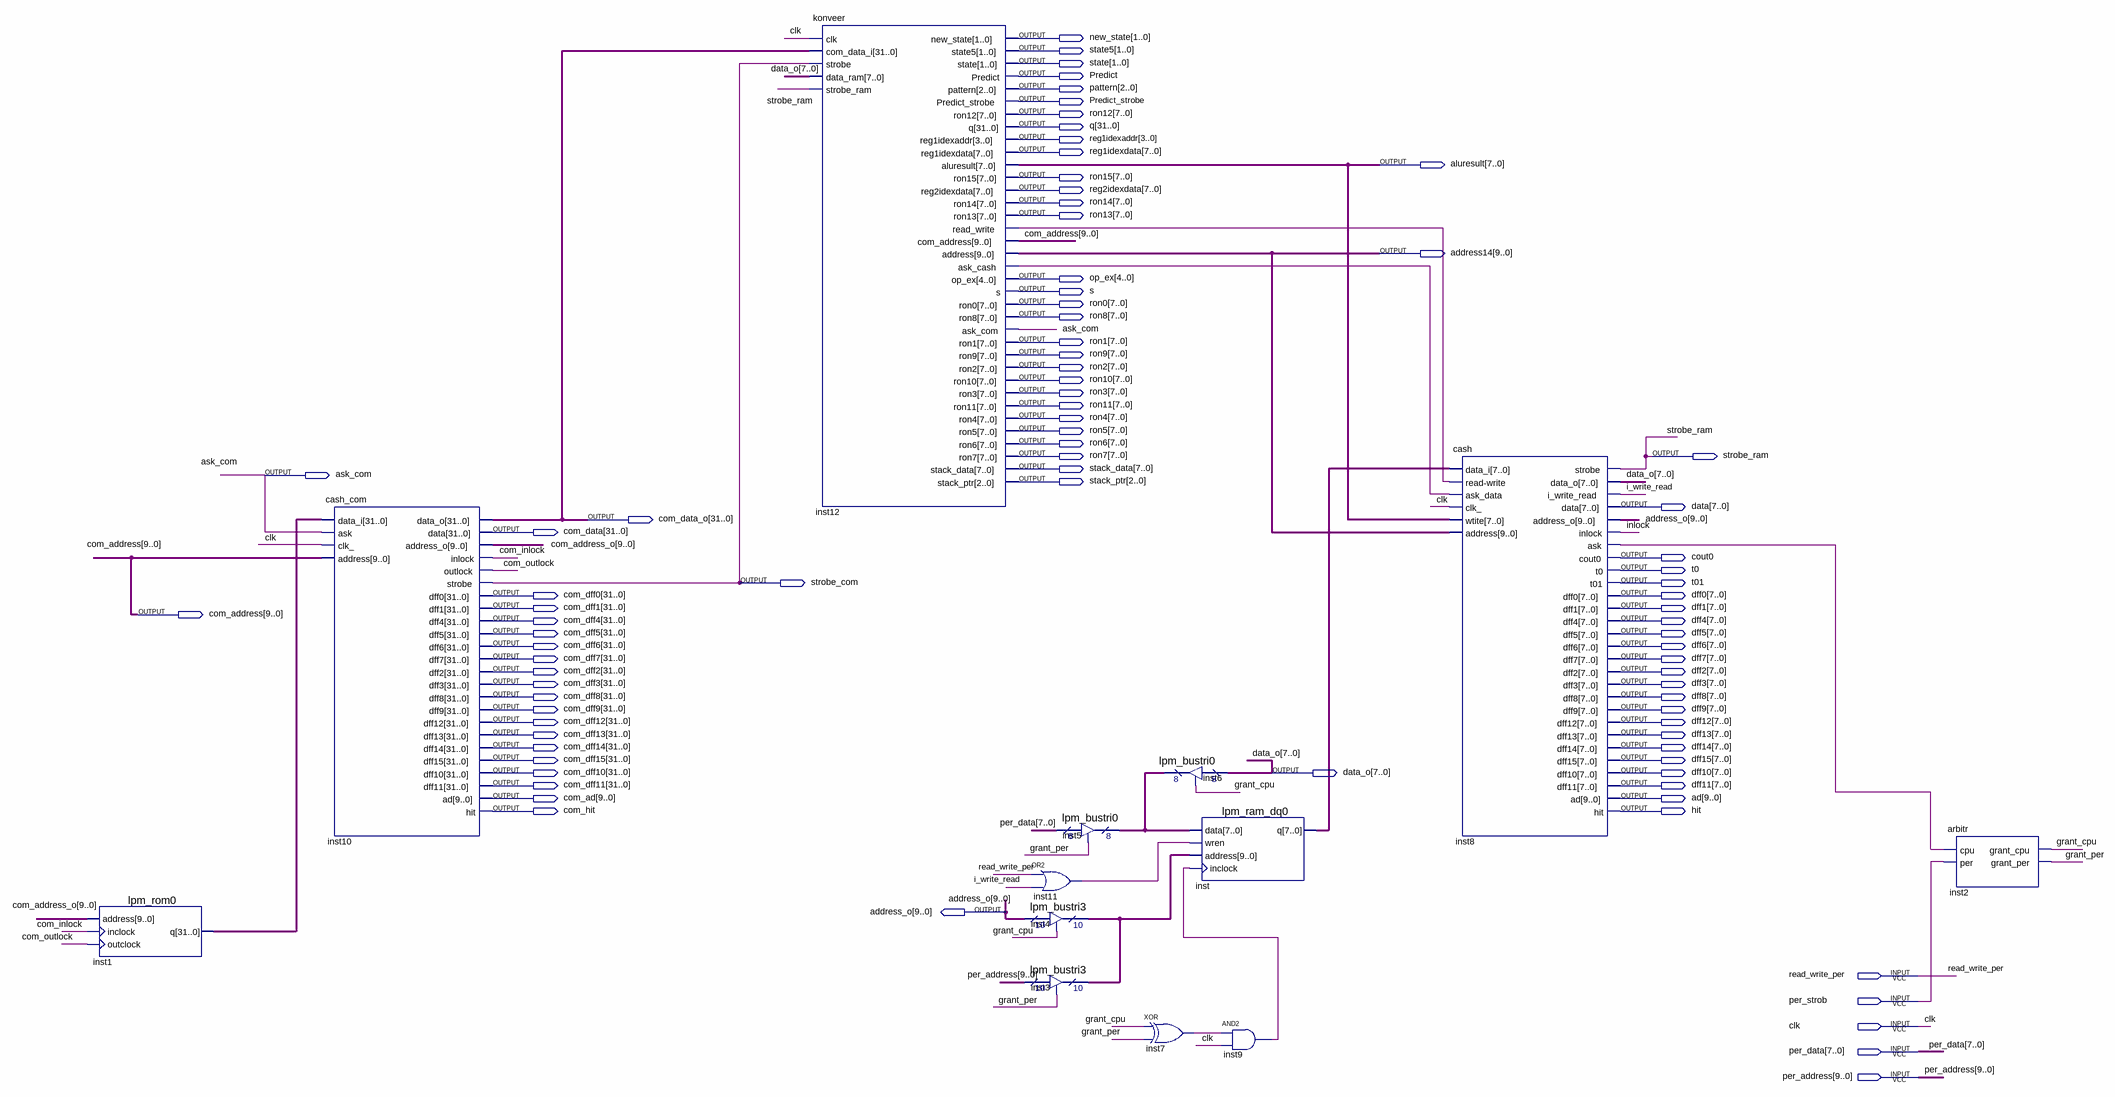
[diagram p0: schematic sheet]
// Quartus schematic kursach.bdf as structural Verilog: 13 symbols, 85 pins
module kursach (
  input  read_write_per,
  input  per_strob,
  input  clk,
  input  [7:0] per_data,
  input  [9:0] per_address,
  output [1:0] new_state,
  output [1:0] state5,
  output [1:0] state,
  output Predict,
  output [2:0] pattern,
  output Predict_strobe,
  output [7:0] ron12,
  output [31:0] q,
  output [3:0] reg1idexaddr,
  output [7:0] reg1idexdata,
  output [7:0] aluresult,
  output [7:0] ron15,
  output [7:0] reg2idexdata,
  output [7:0] ron14,
  output [7:0] ron13,
  output [9:0] address14,
  output [4:0] op_ex,
  output s,
  output [7:0] ron0,
  output [7:0] ron8,
  output [7:0] ron1,
  output [7:0] ron9,
  output [7:0] ron2,
  output [7:0] ron10,
  output [7:0] ron3,
  output [7:0] ron11,
  output [7:0] ron4,
  output [7:0] ron5,
  output [7:0] ron6,
  output [7:0] ron7,
  output strobe_ram,
  output [7:0] stack_data,
  output ask_com,
  output [2:0] stack_ptr,
  output [7:0] data,
  output [31:0] com_data_o,
  output [31:0] com_data,
  output cout0,
  output t0,
  output strobe_com,
  output t01,
  output [31:0] com_dff0,
  output [7:0] dff0,
  output [31:0] com_dff1,
  output [7:0] dff1,
  output [9:0] com_address,
  output [31:0] com_dff4,
  output [7:0] dff4,
  output [31:0] com_dff5,
  output [7:0] dff5,
  output [31:0] com_dff6,
  output [7:0] dff6,
  output [31:0] com_dff7,
  output [7:0] dff7,
  output [31:0] com_dff2,
  output [7:0] dff2,
  output [31:0] com_dff3,
  output [7:0] dff3,
  output [31:0] com_dff8,
  output [7:0] dff8,
  output [31:0] com_dff9,
  output [7:0] dff9,
  output [31:0] com_dff12,
  output [7:0] dff12,
  output [31:0] com_dff13,
  output [7:0] dff13,
  output [31:0] com_dff14,
  output [7:0] dff14,
  output [31:0] com_dff15,
  output [7:0] dff15,
  output [31:0] com_dff10,
  output [7:0] data_o,
  output [7:0] dff10,
  output [31:0] com_dff11,
  output [7:0] dff11,
  output [9:0] com_ad,
  output [9:0] ad,
  output com_hit,
  output hit,
  output [9:0] address_o
);

  wire com_inlock, com_outlock, grant_cpu, grant_per, i_write_read, inlock, inst7_out, inst8_ask, inst9_out,
       inst11_out, inst12_ask_cash, inst12_read_write;
  wire [7:0] inst5_tridata, inst_q;
  wire [9:0] com_address_o, inst4_tridata;
  wire [31:0] inst1_q;

  lpm_rom0 inst1 (.address(com_address_o), .inclock(com_inlock), .outclock(com_outlock), .q(inst1_q));
  cash_com inst10 (
    .data_i(inst1_q), .ask(ask_com), .clk_(clk), .address(com_address), .data_o(com_data_o), .data(com_data),
    .address_o(com_address_o), .inlock(com_inlock), .outlock(com_outlock), .strobe(strobe_com),
    .dff0(com_dff0), .dff1(com_dff1), .dff4(com_dff4), .dff5(com_dff5), .dff6(com_dff6), .dff7(com_dff7),
    .dff2(com_dff2), .dff3(com_dff3), .dff8(com_dff8), .dff9(com_dff9), .dff12(com_dff12), .dff13(com_dff13),
    .dff14(com_dff14), .dff15(com_dff15), .dff10(com_dff10), .dff11(com_dff11), .ad(com_ad), .hit(com_hit));
  konveer inst12 (
    .clk(clk), .com_data_i(com_data_o), .strobe(strobe_com), .data_ram(data_o), .strobe_ram(strobe_ram),
    .new_state(new_state), .state5(state5), .state(state), .Predict(Predict), .pattern(pattern),
    .Predict_strobe(Predict_strobe), .ron12(ron12), .q(q), .reg1idexaddr(reg1idexaddr),
    .reg1idexdata(reg1idexdata), .aluresult(aluresult), .ron15(ron15), .reg2idexdata(reg2idexdata),
    .ron14(ron14), .ron13(ron13), .read_write(inst12_read_write), .com_address(com_address),
    .address(address14), .ask_cash(inst12_ask_cash), .op_ex(op_ex), .s(s), .ron0(ron0), .ron8(ron8),
    .ask_com(ask_com), .ron1(ron1), .ron9(ron9), .ron2(ron2), .ron10(ron10), .ron3(ron3), .ron11(ron11),
    .ron4(ron4), .ron5(ron5), .ron6(ron6), .ron7(ron7), .stack_data(stack_data), .stack_ptr(stack_ptr));
  lpm_bustri0 inst5 (.enabledt(grant_per), .data(per_data), .tridata(inst5_tridata));
  or inst11 (inst11_out, read_write_per, i_write_read);
  lpm_bustri3 inst4 (.enabledt(grant_cpu), .data(address_o), .tridata(inst4_tridata));
  lpm_bustri3 inst3 (.enabledt(grant_per), .data(per_address), .tridata(inst4_tridata));
  xor inst7 (inst7_out, grant_cpu, grant_per);
  lpm_bustri0 inst6 (.enabledt(grant_cpu), .data(data_o), .tridata(inst5_tridata));
  lpm_ram_dq0 inst (.data(inst5_tridata), .wren(inst11_out), .address(inst4_tridata), .inclock(inst9_out), .q(inst_q));
  and inst9 (inst9_out, inst7_out, clk);
  cash inst8 (
    .data_i(inst_q), .\read-write (inst12_read_write), .ask_data(inst12_ask_cash), .clk_(clk),
    .wtite(aluresult), .address(address14), .strobe(strobe_ram), .data_o(data_o),
    .i_write_read(i_write_read), .data(data), .address_o(address_o), .inlock(inlock), .ask(inst8_ask),
    .cout0(cout0), .t0(t0), .t01(t01), .dff0(dff0), .dff1(dff1), .dff4(dff4), .dff5(dff5), .dff6(dff6),
    .dff7(dff7), .dff2(dff2), .dff3(dff3), .dff8(dff8), .dff9(dff9), .dff12(dff12), .dff13(dff13),
    .dff14(dff14), .dff15(dff15), .dff10(dff10), .dff11(dff11), .ad(ad), .hit(hit));
  arbitr inst2 (.cpu(inst8_ask), .per(per_strob), .grant_cpu(grant_cpu), .grant_per(grant_per));
endmodule
